# Altium project TransistorHightKeyBoard.PrjPcb
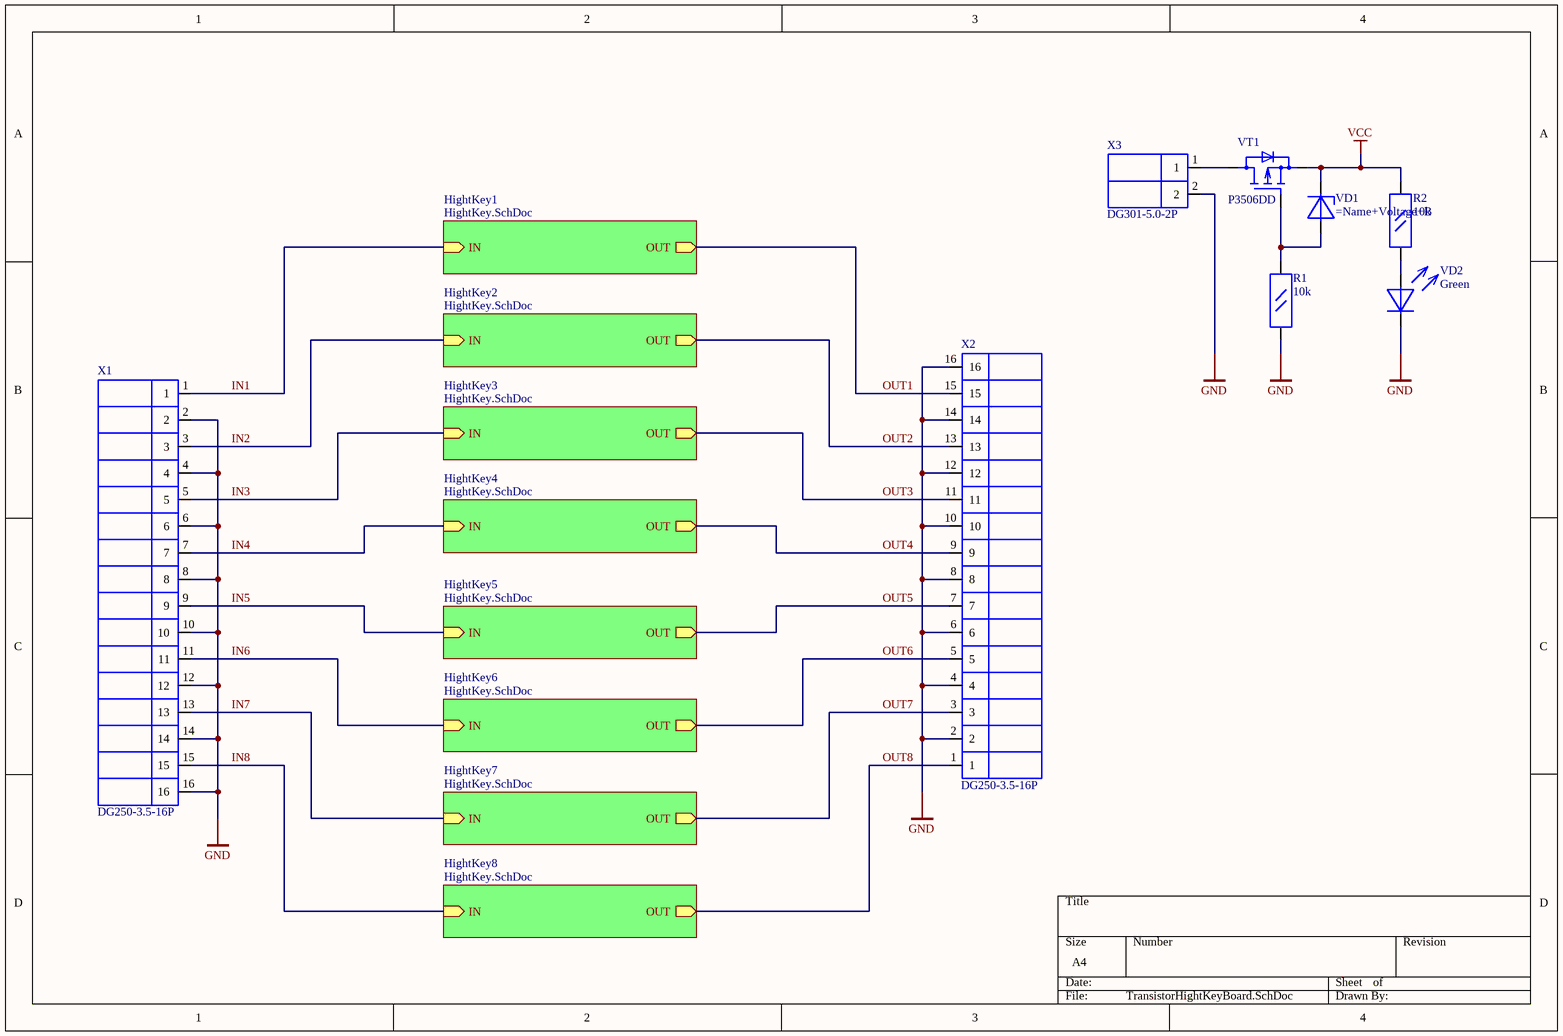
[diagram p0: TransistorHightKeyBoard.SchDoc]
2 sheets, 112 parts. Net scope: hierarchical (ports join the sheet entries above them; power ports are global).
Board file: TransistorHightKeyBoard.PcbDoc
Sheets:
  TransistorHightKeyBoard.SchDoc
    HightKey1 = HightKey.SchDoc
    HightKey2 = HightKey.SchDoc
    HightKey3 = HightKey.SchDoc
    HightKey4 = HightKey.SchDoc
    HightKey5 = HightKey.SchDoc
    HightKey6 = HightKey.SchDoc
    HightKey7 = HightKey.SchDoc
    HightKey8 = HightKey.SchDoc

## Sheet TransistorHightKeyBoard.SchDoc
size A4

### Parts
R1  Resistance (Ohms): 10k  [RES0805]  (hidden comment: R0805)
R2  Resistance (Ohms): 10k  [RES0805]  (hidden comment: R0805)
VD1  (no value)  [SOD323]
VD2  Color: Green  [3mm led green]  (hidden comment: Led Green 3mm)
VT1  P3506DD  [DPAK]
X1  DG250-3.5-16P  [DG250-3.5-16P]
X2  DG250-3.5-16P  [DG250-3.5-16P]
X3  DG301-5.0-2P  [DG301-5.0-2P]

### Sub-sheets
HightKey1 = HightKey.SchDoc: IN (in), OUT (out)
HightKey2 = HightKey.SchDoc: IN (in), OUT (out)
HightKey3 = HightKey.SchDoc: IN (in), OUT (out)
HightKey4 = HightKey.SchDoc: IN (in), OUT (out)
HightKey5 = HightKey.SchDoc: IN (in), OUT (out)
HightKey6 = HightKey.SchDoc: IN (in), OUT (out)
HightKey7 = HightKey.SchDoc: IN (in), OUT (out)
HightKey8 = HightKey.SchDoc: IN (in), OUT (out)

### Nets
GND: R1.1 VD2.1(C) X1.2 X1.4 X1.6 X1.8 X1.10 X1.12 X1.14 X1.16 X2.2 X2.4 X2.6 X2.8 X2.10 X2.12 X2.14 X2.16 X3.2
VCC: R2.2 VD1.1(C) VT1.3(S)
IN1: X1.1 ; sheet HightKey1/IN
IN2: X1.3 ; sheet HightKey2/IN
IN3: X1.5 ; sheet HightKey3/IN
IN4: X1.7 ; sheet HightKey4/IN
IN5: X1.9 ; sheet HightKey5/IN
IN6: X1.11 ; sheet HightKey6/IN
IN7: X1.13 ; sheet HightKey7/IN
IN8: X1.15 ; sheet HightKey8/IN
OUT1: X2.15 ; sheet HightKey1/OUT
OUT2: X2.13 ; sheet HightKey2/OUT
OUT3: X2.11 ; sheet HightKey3/OUT
OUT4: X2.9 ; sheet HightKey4/OUT
OUT5: X2.7 ; sheet HightKey5/OUT
OUT6: X2.5 ; sheet HightKey6/OUT
OUT7: X2.3 ; sheet HightKey7/OUT
OUT8: X2.1 ; sheet HightKey8/OUT
NetR1_2: R1.2 VD1.2(A) VT1.1(G)
NetR2_1: R2.1 VD2.2(A)
NetVT1_2: VT1.2(D) X3.1

### Library data of the parts
R1 R2 = R0805: Resistor; Power (Watts): 1/8W; Package: 0805; Category: Resistors
VD1 = PDZ-B: Diode; Name: PDZ; Voltage: 12; Package: SOD323
VD2 = Led Green 3mm: 3mm Green Led 2.54pitch
VT1 = P3506DD: P-channel MOSFET transistor; Manufacturer: NIKO SEMICONDUCTOR CO; Package: D-PAK(TO-252); Name: P3506DD
X1 X2 = DG250-3.5-16P: 5mm Pitch PCB Terminal Block Connector; Manufacture: DEGSON; Name: DG250-3.5-16P; Pitch: 5mm
X3 = DG301-5.0-2P: 5mm Pitch PCB Terminal Block Connector; Manufacture: DEGSON; Name: DG301-5.0-2P; Pitch: 5mm

## Sheet HightKey.SchDoc
size A4
Used 8 times, as channels HightKey1, HightKey2, HightKey3, HightKey4, HightKey5, HightKey6, HightKey7, HightKey8. Parts and nets are listed once, with the designators drawn on the sheet.
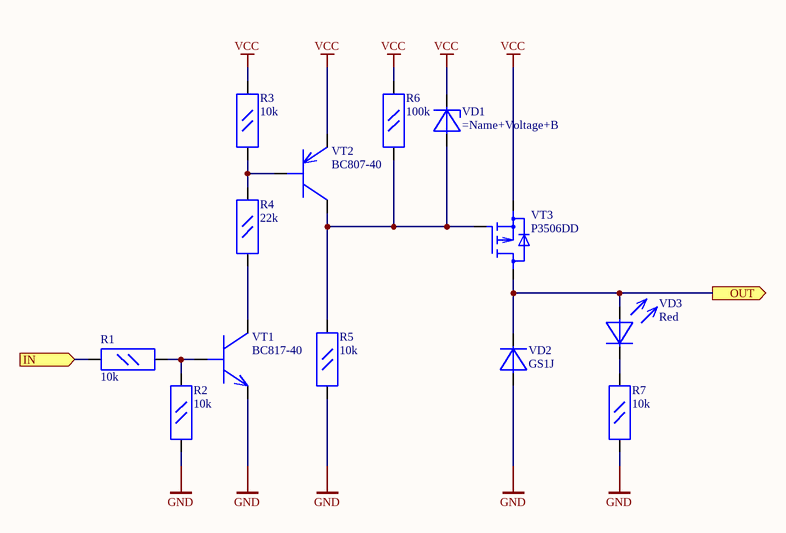
[diagram p1: HightKey.SchDoc]

### Parts
R1  Resistance (Ohms): 10k  [RES0805]  (hidden comment: R0805)
R2  Resistance (Ohms): 10k  [RES0805]  (hidden comment: R0805)
R3  Resistance (Ohms): 10k  [RES0805]  (hidden comment: R0805)
R4  Resistance (Ohms): 22k  [RES0805]  (hidden comment: R0805)
R5  Resistance (Ohms): 10k  [RES0805]  (hidden comment: R0805)
R6  Resistance (Ohms): 100k  [RES0805]  (hidden comment: R0805)
R7  Resistance (Ohms): 10k  [RES0805]  (hidden comment: R0805)
VD1  (no value)  [SOD323]
VD2  GS1J  [DO-214AC(SMA)]
VD3  Color: Red  [3mm led red]  (hidden comment: Led Red 3mm)
VT1  BC817-40  [SOT95P230X110-3N]
VT2  BC807-40  [SOT95P230X110-3N]
VT3  P3506DD  [DPAK]

### Ports
IN (in), OUT (out)

### Nets
GND: R2.1 R5.1 R7.1 VD2.2(A) VT1.2(E)
VCC: R3.2 R6.2 VD1.1(C) VT2.2(E) VT3.3(S)
IN: R1.1 ; port IN
OUT: VD2.1(C) VD3.2(A) VT3.2(D) ; port OUT
NetR1_2: R1.2 R2.2 VT1.1(B)
NetR3_1: R3.1 R4.2 VT2.1(B)
NetR4_1: R4.1 VT1.3(C)
NetR5_2: R5.2 R6.1 VD1.2(A) VT2.3(C) VT3.1(G)
NetR7_2: R7.2 VD3.1(C)

### Channels
HightKey1: designators R1=1R1 R2=1R2 R3=1R3 R4=1R4 R5=1R5 R6=1R6 R7=1R7 VD1=1VD1 VD2=1VD2 VD3=1VD3 VT1=1VT1 VT2=1VT2 VT3=1VT3; ports IN=IN1 OUT=OUT1
HightKey2: designators R1=2R1 R2=2R2 R3=2R3 R4=2R4 R5=2R5 R6=2R6 R7=2R7 VD1=2VD1 VD2=2VD2 VD3=2VD3 VT1=2VT1 VT2=2VT2 VT3=2VT3; ports IN=IN2 OUT=OUT2
HightKey3: designators R1=3R1 R2=3R2 R3=3R3 R4=3R4 R5=3R5 R6=3R6 R7=3R7 VD1=3VD1 VD2=3VD2 VD3=3VD3 VT1=3VT1 VT2=3VT2 VT3=3VT3; ports IN=IN3 OUT=OUT3
HightKey4: designators R1=4R1 R2=4R2 R3=4R3 R4=4R4 R5=4R5 R6=4R6 R7=4R7 VD1=4VD1 VD2=4VD2 VD3=4VD3 VT1=4VT1 VT2=4VT2 VT3=4VT3; ports IN=IN4 OUT=OUT4
HightKey5: designators R1=5R1 R2=5R2 R3=5R3 R4=5R4 R5=5R5 R6=5R6 R7=5R7 VD1=5VD1 VD2=5VD2 VD3=5VD3 VT1=5VT1 VT2=5VT2 VT3=5VT3; ports IN=IN5 OUT=OUT5
HightKey6: designators R1=6R1 R2=6R2 R3=6R3 R4=6R4 R5=6R5 R6=6R6 R7=6R7 VD1=6VD1 VD2=6VD2 VD3=6VD3 VT1=6VT1 VT2=6VT2 VT3=6VT3; ports IN=IN6 OUT=OUT6
HightKey7: designators R1=7R1 R2=7R2 R3=7R3 R4=7R4 R5=7R5 R6=7R6 R7=7R7 VD1=7VD1 VD2=7VD2 VD3=7VD3 VT1=7VT1 VT2=7VT2 VT3=7VT3; ports IN=IN7 OUT=OUT7
HightKey8: designators R1=8R1 R2=8R2 R3=8R3 R4=8R4 R5=8R5 R6=8R6 R7=8R7 VD1=8VD1 VD2=8VD2 VD3=8VD3 VT1=8VT1 VT2=8VT2 VT3=8VT3; ports IN=IN8 OUT=OUT8

### Library data of the parts
R1-R7 = R0805: Resistor; Power (Watts): 1/8W; Package: 0805; Category: Resistors
VD1 = PDZ-B: Diode; Name: PDZ; Voltage: 12; Package: SOD323
VD2 = GS1J: 1.0A Surface Mount Standard Diode; Manufacturer: WTE; Voltage: 600V; Name: GS1J; Package: SMA(DO-214AC)
VD3 = Led Red 3mm: 3mm Red Led 2.54pitch
VT1 = BC817-40: NPN bipolar transistor; Package: SOT23; Name: BC817-40
VT2 = BC807-40: PNP bipolar transistor; Package: SOT23; Name: BC807-40
VT3 = P3506DD: as VT1 on sheet TransistorHightKeyBoard; Package: D-PAK(TO-252); Name: P3506DD

## Nets that join several sheets
GND: TransistorHightKeyBoard (19 pins), HightKey1 (5 pins), HightKey2 (5 pins), HightKey3 (5 pins), HightKey4 (5 pins), HightKey5 (5 pins), HightKey6 (5 pins), HightKey7 (5 pins), HightKey8 (5 pins)
VCC: TransistorHightKeyBoard (R2.2 VD1.1 VT1.3), HightKey1 (5 pins), HightKey2 (5 pins), HightKey3 (5 pins), HightKey4 (5 pins), HightKey5 (5 pins), HightKey6 (5 pins), HightKey7 (5 pins), HightKey8 (5 pins)
IN1: TransistorHightKeyBoard (X1.1), HightKey1 (1R1.1)
IN2: TransistorHightKeyBoard (X1.3), HightKey2 (2R1.1)
IN3: TransistorHightKeyBoard (X1.5), HightKey3 (3R1.1)
IN4: TransistorHightKeyBoard (X1.7), HightKey4 (4R1.1)
IN5: TransistorHightKeyBoard (X1.9), HightKey5 (5R1.1)
IN6: TransistorHightKeyBoard (X1.11), HightKey6 (6R1.1)
IN7: TransistorHightKeyBoard (X1.13), HightKey7 (7R1.1)
IN8: TransistorHightKeyBoard (X1.15), HightKey8 (8R1.1)
OUT1: TransistorHightKeyBoard (X2.15), HightKey1 (1VD2.1 1VD3.2 1VT3.2)
OUT2: TransistorHightKeyBoard (X2.13), HightKey2 (2VD2.1 2VD3.2 2VT3.2)
OUT3: TransistorHightKeyBoard (X2.11), HightKey3 (3VD2.1 3VD3.2 3VT3.2)
OUT4: TransistorHightKeyBoard (X2.9), HightKey4 (4VD2.1 4VD3.2 4VT3.2)
OUT5: TransistorHightKeyBoard (X2.7), HightKey5 (5VD2.1 5VD3.2 5VT3.2)
OUT6: TransistorHightKeyBoard (X2.5), HightKey6 (6VD2.1 6VD3.2 6VT3.2)
OUT7: TransistorHightKeyBoard (X2.3), HightKey7 (7VD2.1 7VD3.2 7VT3.2)
OUT8: TransistorHightKeyBoard (X2.1), HightKey8 (8VD2.1 8VD3.2 8VT3.2)